# Altium schematic sheet main.SchDoc
size A; SheetNumber: 1; SheetTotal: 1
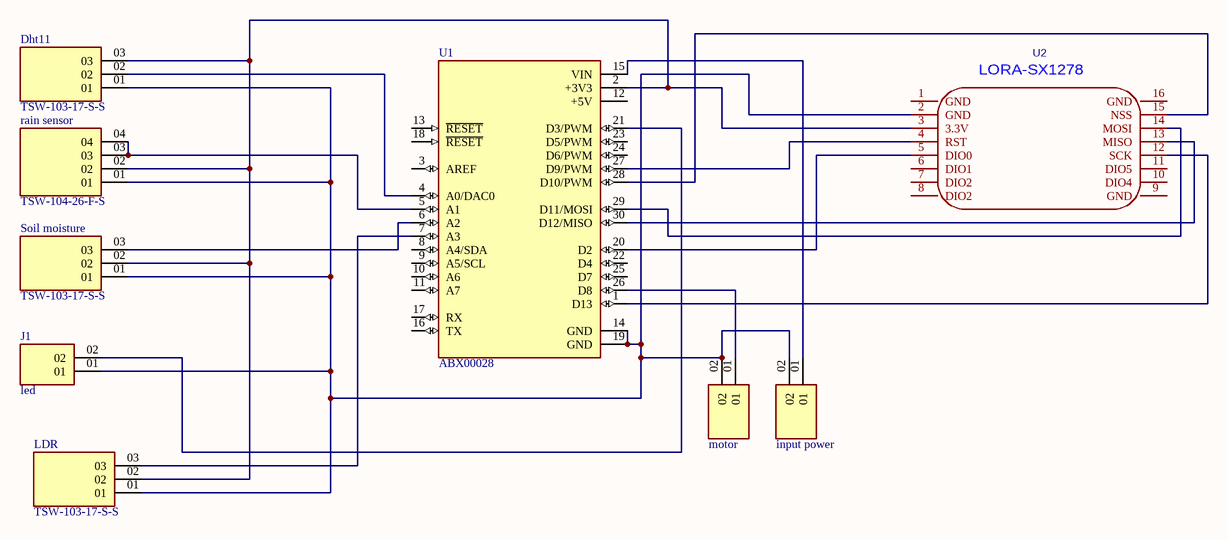
[diagram p0: main.SchDoc]

## Parts
Dht11  TSW-103-17-S-S  [SAMTEC_TSW-103-17-S-S]
input_power  HMTSW-102-XX-X-S-XXX  [SAMTEC_HMTSW-102-XX-X-S-XXX]  (value not drawn)
J1  led  [SAMTEC_HMTSW-102-XX-X-S-XXX]
LDR  TSW-103-17-S-S  [SAMTEC_TSW-103-17-S-S]
motor  HMTSW-102-XX-X-S-XXX  [SAMTEC_HMTSW-102-XX-X-S-XXX]  (value not drawn)
rain_sensor  TSW-104-26-F-S  [SAMTEC_TSW-104-26-F-S]
Soil_moisture  TSW-103-17-S-S  [SAMTEC_TSW-103-17-S-S]
U1  ABX00028  [MODULE_ABX00028]
U2  LORA-SX1278-SYMBOL  [LORA-SX1278]  (value not drawn)

## Nets
NetDht11_01: Dht11.01 input_power.02 J1.01 LDR.01 motor.02 rain_sensor.01 Soil_moisture.01 U1.14(GND) U1.19(GND) U2.2(GND)
NetDht11_02: Dht11.02 U1.4(A0/DAC0)
NetDht11_03: Dht11.03 LDR.02 rain_sensor.02 Soil_moisture.02 U1.2(+3V3) U2.3(3.3V)
Netinput_power_01: input_power.01 U1.15(VIN)
NetJ1_02: J1.02 U1.21(D3/PWM)
NetLDR_03: LDR.03 U1.7(A3)
Netmotor_01: motor.01 U1.26(D8)
Netrain_sensor_03: rain_sensor.03 rain_sensor.04 U1.5(A1)
NetSoil_moisture_03: Soil_moisture.03 U1.6(A2)
NetU1_1: U1.1(D13) U2.12(SCK)
NetU1_20: U1.20(D2) U2.5(DIO0)
NetU1_27: U1.27(D9/PWM) U2.4(RST)
NetU1_28: U1.28(D10/PWM) U2.15(NSS)
NetU1_29: U1.29(D11/MOSI) U2.14(MOSI)
NetU1_30: U1.30(D12/MISO) U2.13(MISO)

Not connected (* = marked no-connect by the designer): U1 3(AREF) 8(A4/SDA) 9(A5/SCL) 10(A6) 11(A7) 12(+5V) 13(~{RESET}) 16(TX) 17(RX) 18(~{RESET}) 22(D4) 23(D5/PWM) 24(D6/PWM) 25(D7); U2 1(GND) 6(DIO1) 7(DIO2) 8(DIO2) 9(GND) 10(DIO4) 11(DIO5) 16(GND)

## Notes on the sheet
- (in symbol LORA-SX1278-SYMBOL) LORA-SX1278

## Library data of the parts
input_power J1 motor = HMTSW-102-XX-X-S-XXX: Connector Header Through Hole 2 position 0.100" (2.54mm); Price: None; Value: *; Package: None; Availability: Unavailable; MP: HMTSW-102-XX-X-S-XXX
U1 = ABX00028: Arduinoâ€™s 5V compatible board in the smallest available form factor: 45x18mm!; MP: Arduino Nano Every; Check_prices: https://www.snapeda.com/parts/Arduino%20Nano%20Every/Arduino/view-part/?ref=eda; Value: *; Availability: Not in stock; Price: None; Package: None; SnapEDA_Link: https://www.snapeda.com/parts/Arduino%20Nano%20Every/Arduino/view-part/?ref=snap; MF: Arduino
U2 = LORA-SX1278-SYMBOL: Contributor: iamdecoder; spicePre: U; spiceSymbolName: LORA-SX1278-SYMBOL
Dht11 LDR Soil_moisture = TSW-103-17-S-S: Package: None; Price: None; Value: *; MP: TSW-103-17-S-S; Availability: Unavailable
rain_sensor = TSW-104-26-F-S: Package: None; Price: None; Value: *; MP: TSW-104-26-F-S; Availability: Unavailable